# EAGLE design hsweg01-v0.3.1 (EAGLE 6.1)
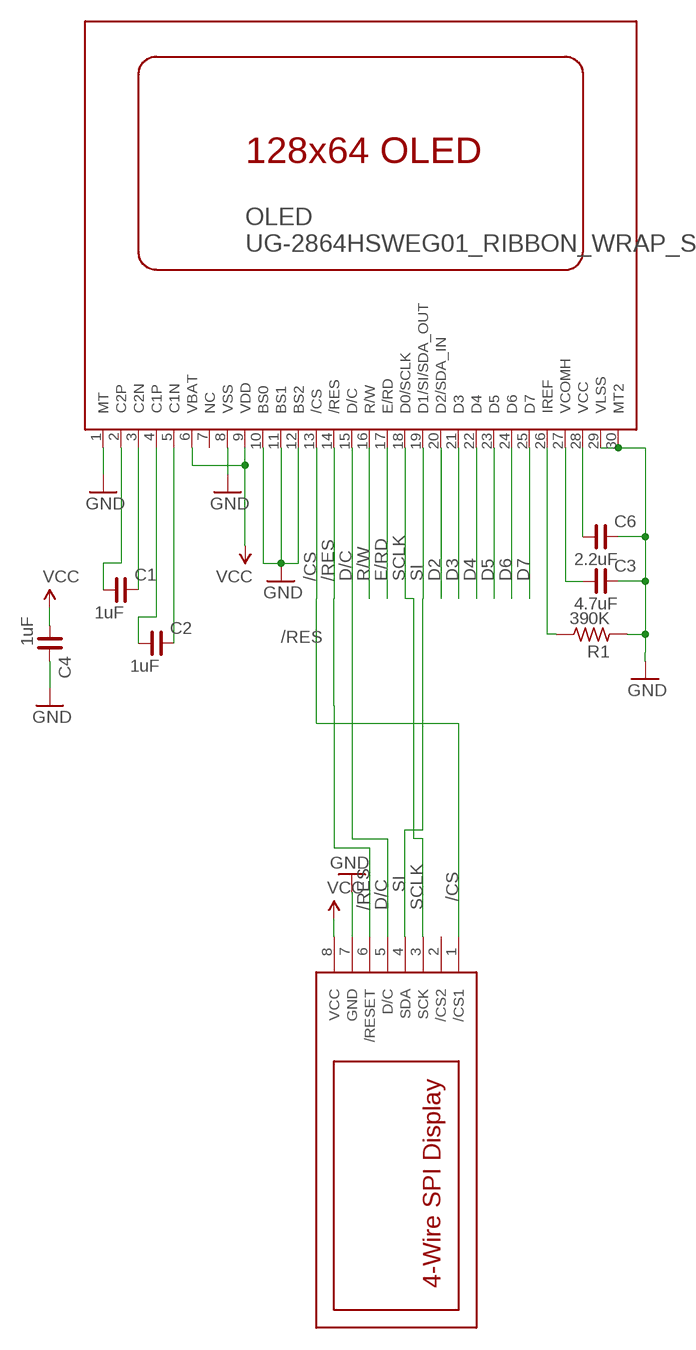
[diagram p0: schematic, sheet 1]

## Parts
C1  1uF  C_0603  [C0603]
C2  1uF  C_0603  [C0603]
C3  4.7uF  C_0805  [C0805]
C4  1uF  C_0603  [C0603]
C6  2.2uF  C_0805  [C0805]
OLED  UG-2864HSWEG01_RIBBON_WRAP_SILK  [UG-2864HSWEG01]
R1  390K  R_0603  [R0603]
U$1  4W-SPI-DISP  [1X08-NOSILK]

## Nets
/CS: OLED.13(/CS) U$1.1(/CS1)
/RES: OLED.14(/RES) U$1.6(/RESET)
D2: OLED.20(D2/SDA_IN)
D3: OLED.21(D3)
D4: OLED.22(D4)
D5: OLED.23(D5)
D6: OLED.24(D6)
D7: OLED.25(D7)
D/C: OLED.15(D/C) U$1.5(D/C)
E/RD: OLED.17(E/RD)
GND: C3.2 C4.2 C6.2 OLED.1(MT) OLED.8(VSS) OLED.10(BS0) OLED.11(BS1) OLED.12(BS2) OLED.29(VLSS) OLED.30(MT2) R1.1 U$1.7(GND)
N$1: C6.1 OLED.28(VCC)
N$4: C1.2 OLED.3(C2N)
N$5: C1.1 OLED.2(C2P)
N$6: C2.1 OLED.4(C1P)
N$7: C2.2 OLED.5(C1N)
N$8: OLED.26(IREF) R1.2
N$13: C3.1 OLED.27(VCOMH)
R/W: OLED.16(R/W)
SCLK: OLED.18(D0/SCLK) U$1.3(SCK)
SI: OLED.19(D1/SI/SDA_OUT) U$1.4(SDA)
VCC: C4.1 OLED.6(VBAT) OLED.9(VDD) U$1.8(VCC)
Unconnected: OLED.7(NC) U$1.2(/CS2)

## Library data of the parts
C1-C4 C6 = rc-master-smd:C_: NON-POLARIZED CAP
OLED = adafruit_my:UG-2864HSWEG01: UG-2864HSWEG01 OLED display
R1 = rc-master-smd:R_: RESISTOR
U$1 = es:4W-SPI-DISP

## Board
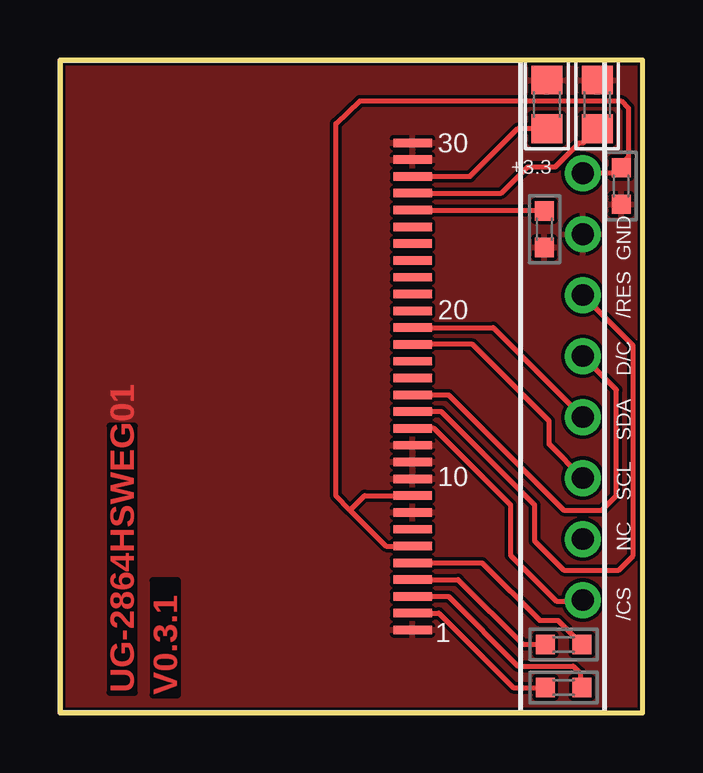
[diagram p1: board, top side]

Size 24.3 x 27.2 mm. Coordinates in mm from the lower left corner, seen from the top.
Outline: 0,0 24.3,0 24.3,27.2 0,27.2 0,0
Copper layers (1*16): Top 0.035mm / dielectric 1.5mm / Bottom 0.035mm
Design rules: minimum track width 0.1mm, minimum drill 0.4mm, track to track 0.15mm, track to pad 0.15mm, pad to pad 0.15mm, via to via 0.15mm, smd to smd 0.15mm, copper to edge 0.12mm, drill to drill 0.12mm, minimum pad ring 0.3mm, minimum via ring 6mil, stop-mask expansion 0mil, vias tented up to drill 25mil, thermal gap 0.15mm

### Footprints (pad centres in the part's own frame; a part is rotated, then mirrored left to right if it is on the bottom)
C0603 = smd 0.8 x 0.8: 1 -0.762,0; 2 0.762,0
C0805 = smd 1.2 x 1.3: 1 -1.016,0; 2 1.016,0
UG-2864HSWEG01 = smd 0.35 x 1.6: 1 -10.15,0; 2 -9.45,0; 3 -8.75,0; 4 -8.05,0; 5 -7.35,0; 6 -6.65,0; 7 -5.95,0; 8 -5.25,0; 9 -4.55,0; 10 -3.85,0; 11 -3.15,0; 12 -2.45,0; 13 -1.75,0; 14 -1.05,0; 15 -0.35,0; 16 0.35,0; 17 1.05,0; 18 1.75,0; 19 2.45,0; 20 3.15,0; 21 3.85,0; 22 4.55,0; 23 5.25,0; 24 5.95,0; 25 6.65,0; 26 7.35,0; 27 8.05,0; 28 8.75,0; 29 9.45,0; 30 10.15,0
R0603 = smd 0.8 x 0.8: 1 -0.762,0; 2 0.762,0
1X08-NOSILK = drill 0.9: 1 0,0; 2 2.54,0; 3 5.08,0; 4 7.62,0; 5 10.16,0; 6 12.7,0; 7 15.24,0; 8 17.78,0

### Placement (x,y rotation side)
C1  21,1.05 0 top
C2  21,2.85 0 top
C3  22.4,25.35 90 top
C4  23.4,21.95 270 top
C6  20.3,25.35 90 top
OLED  14.7,13.6 90 top
R1  20.2,20.15 90 top
U$1  21.8,4.7 90 top

### Tracks (layer width: path | path; a pad name or v marks a point on that pad's centre or on a via)
/CS
  Top 0.2: OLED.13 15.6,11.85 18.8,8.65 18.8,6.55 20.7,4.65 22.05,4.65 U$1.1
/RES
  Top 0.2: OLED.14 15.9,12.55 19.8,8.65 19.8,7.15 21,5.95 23.3,5.95 23.9,6.55 23.9,15.3 U$1.6
D/C
  Top 0.2: OLED.15 16.2,13.25 21,8.45 22.6,8.45 23.2,9.05 23.2,13.46 U$1.5
GND
  pour Top: -3,30.25 -3.3,-1.95 24.6,-1.85 24.9,30.45
N$1
  Top 0.2: OLED.28 17.1,22.35 19.1,24.35 20.28,24.35 C6.1
N$4
  Top 0.2: OLED.3 16.2,4.85 19.1,1.95 21.4,1.95 21.7,1.65 21.7,1.11 C1.2
N$5
  Top 0.2: OLED.2 15.8,4.15 18.9,1.05 C1.1
N$6
  Top 0.2: OLED.4 16.6,5.55 19.3,2.85 C2.1
N$7
  Top 0.2: OLED.5 17.6,6.25 20,3.85 20.76,3.85 C2.2
N$8
  Top 0.2: OLED.26 20.14,20.95 20.18,20.91 R1.2
N$13
  Top 0.2: OLED.27 18.4,21.65 19.5,22.75 20.65,22.75 21.65,23.75 21.82,23.75 C3.1
SCLK
  Top 0.2: OLED.18 17.2,15.35 20.4,12.15 20.4,11.18 U$1.3
SI
  Top 0.2: OLED.19 18.07,16.05 U$1.4
VCC
  Top 0.2: 12.1,8.45 11.5,9.05 11.5,24.55 12.5,25.5 23.4,25.5 23.7,25.2 23.7,23.15 23.4,22.85 C4.1 23.17,22.48 U$1.8 | 12.1,8.45 13.6,6.95 OLED.6 | OLED.9 12.7,9.05 12.1,8.45

### Text on the board
Top: UG-2864HSWEG01 | V0.3.1
tNames: +3.3 | GND | /RES | D/C | SDA | SCL | NC | /CS